# Altium project miniFOdriver_V1.0.PrjPcb
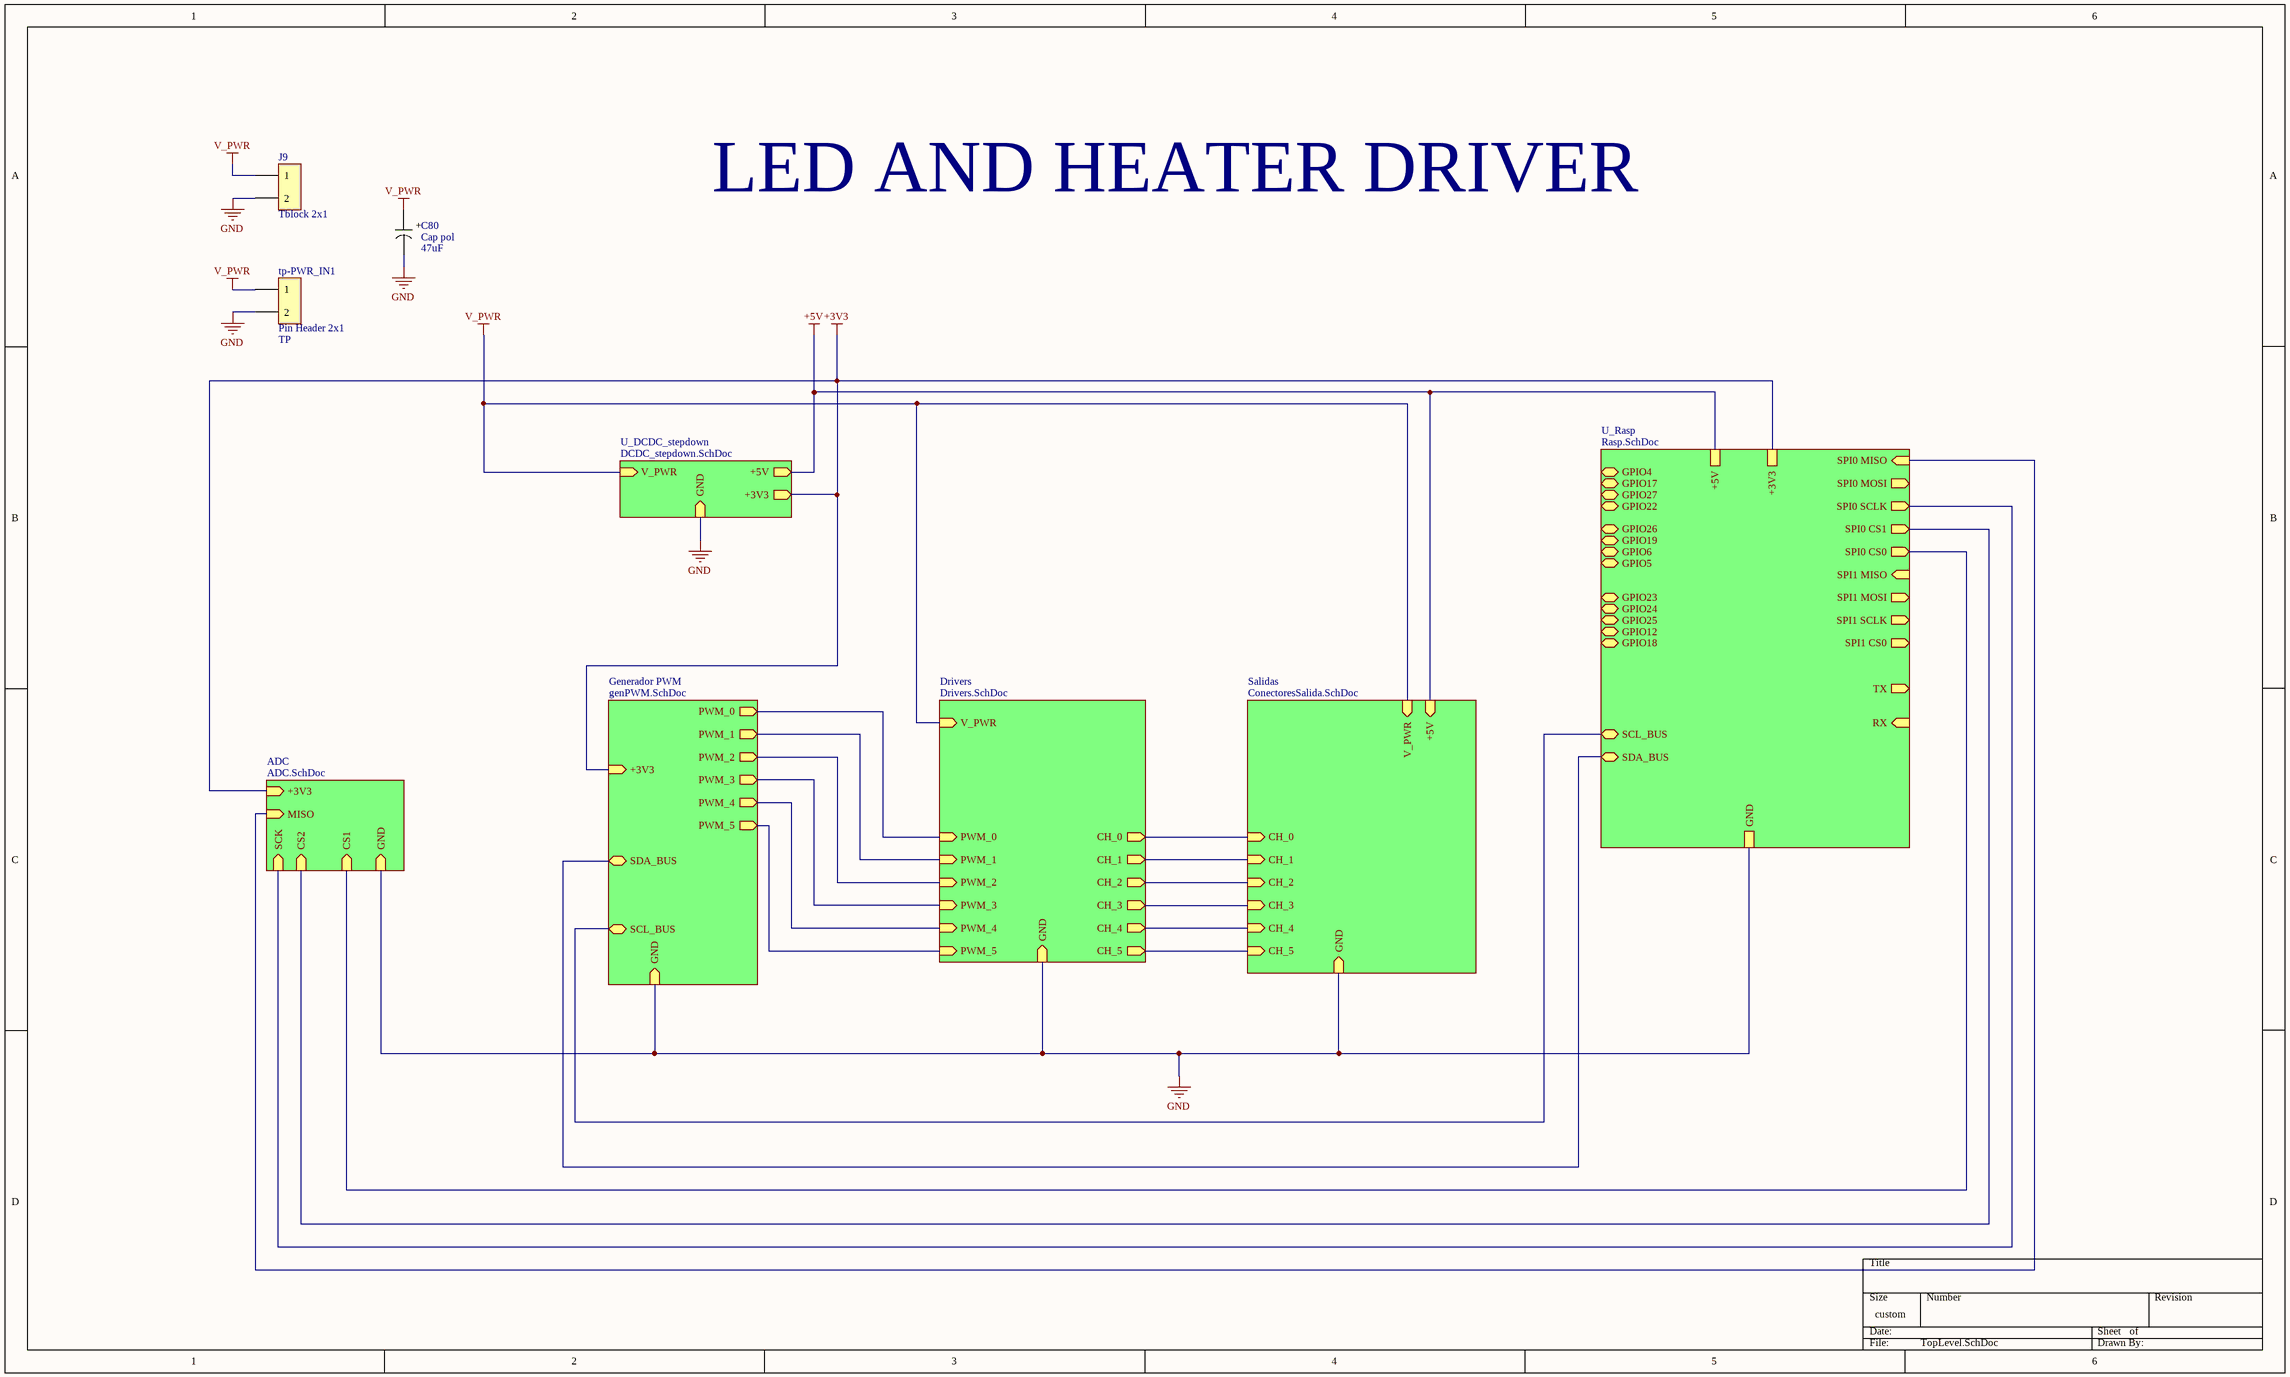
[diagram p0: TopLevel.SchDoc]
7 sheets, 67 parts. Net scope: hierarchical (ports join the sheet entries above them; power ports are global).
Board file: PCB1.PcbDoc
Sheets:
  TopLevel.SchDoc
    Generador PWM = genPWM.SchDoc
    Drivers = Drivers.SchDoc
    Salidas = ConectoresSalida.SchDoc
    ADC = ADC.SchDoc
    U_DCDC_stepdown = DCDC_stepdown.SchDoc
    U_Rasp = Rasp.SchDoc

## Sheet TopLevel.SchDoc
size 508 x 304 mm; DrawnBy: Constanza Barriga; SheetNumber: 1; SheetTotal: 10

### Parts
C80  Cap pol  value 47uF  [CAP_SMD_Electrolytic_5X5.4]
J9  Tblock 2x1  [T_BLOCK_2P]
tp-PWR_IN1  Pin Header 2x1  [HDR-TH_P2.54-H-M_A2541WV-2P]

### Sub-sheets
ADC = ADC.SchDoc: +3V3 (in), GND (in), SCK (in), CS2 (in), MISO (in), CS1 (in)
Drivers = Drivers.SchDoc: GND (in), PWM_4 (in), PWM_3 (in), PWM_2 (in), PWM_1 (in), PWM_0 (in), V_PWR (in), CH_0 (out), CH_1 (out), CH_2 (out), CH_3 (out), CH_4 (out), CH_5 (out), PWM_5 (in)
Generador PWM = genPWM.SchDoc: PWM_0 (out), PWM_1 (out), PWM_2 (out), PWM_3 (out), PWM_4 (out), +3V3 (in), SDA_BUS (bidir), SCL_BUS (bidir), GND (in), PWM_5 (out)
Salidas = ConectoresSalida.SchDoc: V_PWR (in), +5V (in), CH_0 (in), CH_1 (in), CH_2 (in), CH_3 (in), CH_4 (in), GND (in), CH_5 (in)
U_DCDC_stepdown = DCDC_stepdown.SchDoc: V_PWR (in), GND (in), +5V (out), +3V3 (out)
U_Rasp = Rasp.SchDoc: GPIO4 (bidir), GPIO17 (bidir), GPIO27 (bidir), GPIO22 (bidir), SPI0 MOSI (out), SPI0 MISO (in), SPI0 SCLK (out), GPIO26 (bidir), GPIO19 (bidir), GPIO6 (bidir), GPIO5 (bidir), SPI1 MISO (in), SPI1 MOSI (out), SPI0 CS1 (out), SPI1 SCLK (out), SPI0 CS0 (out), RX (in), TX (out), GPIO23 (bidir), GPIO24 (bidir), GPIO25 (bidir), GPIO12 (bidir), SPI1 CS0 (out), GPIO18 (bidir), +5V, +3V3, GND, SCL_BUS (bidir), SDA_BUS (bidir)

### Nets
+3V3: sheet Generador PWM/+3V3, sheet ADC/+3V3, sheet U_DCDC_stepdown/+3V3, sheet U_Rasp/+3V3
+5V: sheet Salidas/+5V, sheet U_DCDC_stepdown/+5V, sheet U_Rasp/+5V
CS1: sheet ADC/CS1, sheet U_Rasp/SPI0 CS0
CS2: sheet ADC/CS2, sheet U_Rasp/SPI0 CS1
GND: C80.1 J9.2 tp-PWR_IN1.2 ; sheet Generador PWM/GND, sheet Drivers/GND, sheet Salidas/GND, sheet ADC/GND, sheet U_DCDC_stepdown/GND, sheet U_Rasp/GND
SCK: sheet ADC/SCK, sheet U_Rasp/SPI0 SCLK
SO: sheet ADC/MISO, sheet U_Rasp/SPI0 MISO
V_PWR: C80.2 J9.1 tp-PWR_IN1.1 ; sheet Drivers/V_PWR, sheet Salidas/V_PWR, sheet U_DCDC_stepdown/V_PWR
CH_0_aux: sheet Drivers/CH_0, sheet Salidas/CH_0
CH_1_aux: sheet Drivers/CH_1, sheet Salidas/CH_1
CH_2_aux: sheet Drivers/CH_2, sheet Salidas/CH_2
CH_3_aux: sheet Drivers/CH_3, sheet Salidas/CH_3
CH_4_aux: sheet Drivers/CH_4, sheet Salidas/CH_4
CH_5_aux: sheet Drivers/CH_5, sheet Salidas/CH_5
PWM_0_in: sheet Generador PWM/PWM_0, sheet Drivers/PWM_0
PWM_1_in: sheet Generador PWM/PWM_1, sheet Drivers/PWM_1
PWM_2_in: sheet Generador PWM/PWM_2, sheet Drivers/PWM_2
PWM_3_in: sheet Generador PWM/PWM_3, sheet Drivers/PWM_3
PWM_4_in: sheet Generador PWM/PWM_4, sheet Drivers/PWM_4
PWM_5_in: sheet Generador PWM/PWM_5, sheet Drivers/PWM_5
SCL_BUS: sheet Generador PWM/SCL_BUS, sheet U_Rasp/SCL_BUS
SDA_BUS: sheet Generador PWM/SDA_BUS, sheet U_Rasp/SDA_BUS

### Notes on the sheet
- LED AND HEATER DRIVER
- (near tp-PWR_IN1) TP
- (in symbol Cap pol) +

### Library data of the parts
C80 = Cap pol: Electrolytic Aluminium Capacitor; Manufacturer: *; Manufacturer Part Number: *; Supplier 1: LCSC; Supplier Part Number 1: *; Voltage: *; Package: *
J9 = Header - 2x1b: Screw terminal 2pos, 1 row, 5pitch; Manufacturer: CJT(Changjiang Connectors); Manufacturer Part Number: A2547WV-2P; Pitch: 2.54mm; Description: P=5.0mm Screw terminal ROHS; Supplier 1: LCSC; Supplier Part Number 1: C8404; Package: Through Hole,P=2.54mm
tp-PWR_IN1 = Header - 2x1c: Pin Header 2pos, 1 row, 2.54 pitch; Manufacturer: CJT(Changjiang Connectors); Manufacturer Part Number: A2541WV-2P; Pitch: 2.54; Supplier 1: LCSC; Supplier Part Number 1: C492401

## Sheet genPWM.SchDoc
size 381 x 203 mm
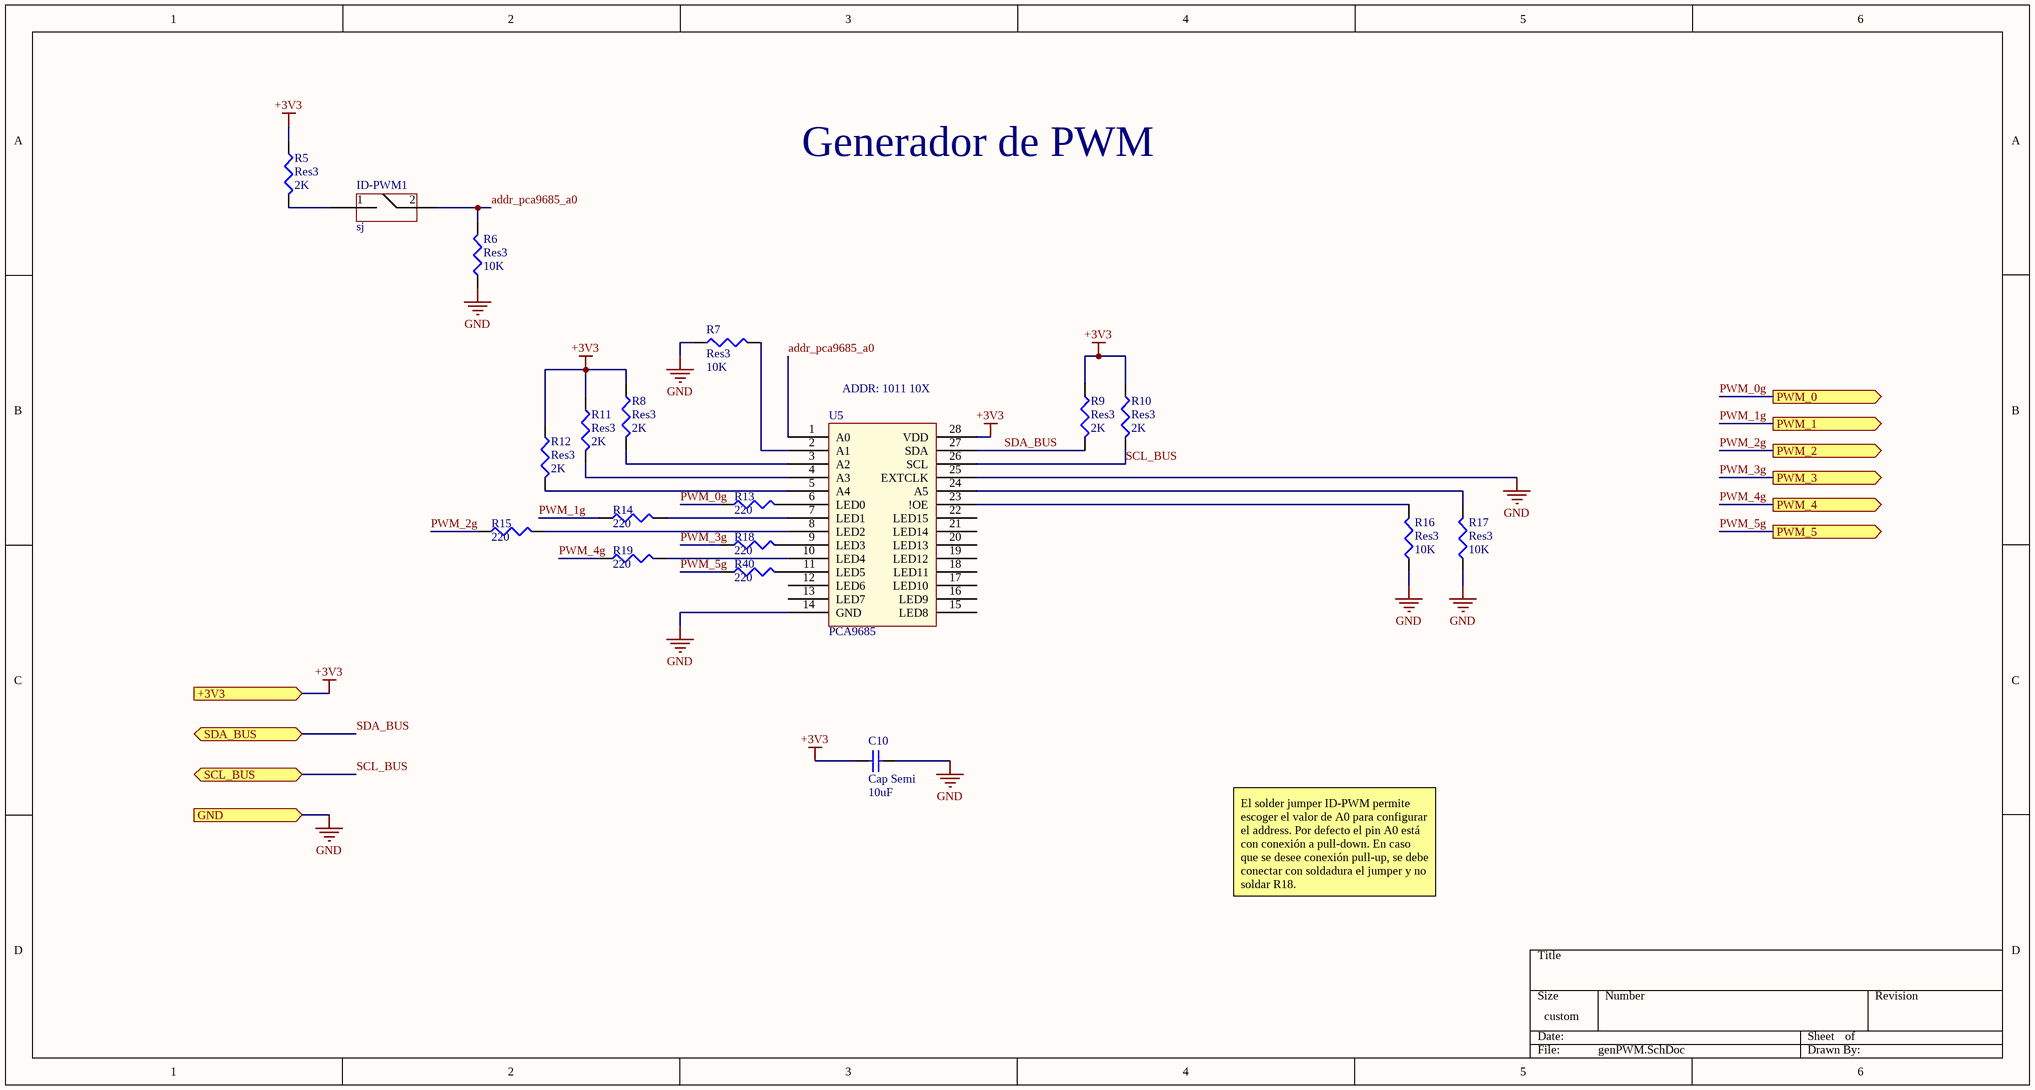
[diagram p1: genPWM.SchDoc]

### Parts
C10  Cap Semi  value 10uF  [1608[0603]]
ID-PWM1  sj  [SJ2]
R5  Res3  value 2K  [J1-0603]
R6  Res3  value 10K  [J1-0603]
R7  Res3  value 10K  [J1-0603]
R8  Res3  value 2K  [J1-0603]
R9  Res3  value 2K  [J1-0603]
R10  Res3  value 2K  [J1-0603]
R11  Res3  value 2K  [J1-0603]
R12  Res3  value 2K  [J1-0603]
R13  value 220  [J1-0603]  (hidden comment: Res3)
R14  value 220  [J1-0603]  (hidden comment: Res3)
R15  value 220  [J1-0603]  (hidden comment: Res3)
R16  Res3  value 10K  [J1-0603]
R17  Res3  value 10K  [J1-0603]
R18  value 220  [J1-0603]  (hidden comment: Res3)
R19  value 220  [J1-0603]  (hidden comment: Res3)
R40  value 220  [J1-0603]  (hidden comment: Res3)
U5  PCA9685  [SSOP-28_L]

### Ports
+3V3 (in), GND (in), PWM_0 (out), PWM_1 (out), PWM_2 (out), PWM_3 (out), PWM_4 (out), PWM_5 (out), SCL_BUS (bidir), SDA_BUS (bidir)

### Nets
+3V3: C10.2 R5.1 R8.1 R9.1 R10.1 R11.1 R12.1 U5.28(VDD) ; port +3V3
GND: C10.1 R6.1 R7.1 R16.1 R17.1 U5.14(GND) U5.25(EXTCLK) ; port GND
addr_pca9685_a0: ID-PWM1.2 R6.2 U5.1(A0)
PWM_0g: R13.1 ; port PWM_0  [project net PWM_0_in]
PWM_1g: R14.1 ; port PWM_1  [project net PWM_1_in]
PWM_2g: R15.1 ; port PWM_2  [project net PWM_2_in]
PWM_3g: R18.1 ; port PWM_3  [project net PWM_3_in]
PWM_4g: R19.1 ; port PWM_4  [project net PWM_4_in]
PWM_5g: R40.1 ; port PWM_5  [project net PWM_5_in]
SCL_BUS: R10.2 U5.26(SCL) ; port SCL_BUS
SDA_BUS: R9.2 U5.27(SDA) ; port SDA_BUS
NetID-PWM1_1: ID-PWM1.1 R5.2
NetR7_2: R7.2 U5.2(A1)
NetR8_2: R8.2 U5.3(A2)
NetR11_2: R11.2 U5.4(A3)
NetR12_2: R12.2 U5.5(A4)
NetR13_2: R13.2 U5.6(LED0)
NetR14_2: R14.2 U5.7(LED1)
NetR15_2: R15.2 U5.8(LED2)
NetR16_2: R16.2 U5.23(!OE)
NetR17_2: R17.2 U5.24(A5)
NetR18_2: R18.2 U5.9(LED3)
NetR19_2: R19.2 U5.10(LED4)
NetR40_2: R40.2 U5.11(LED5)

Not connected (* = marked no-connect by the designer): U5 12(LED6) 13(LED7) 15(LED8) 16(LED9) 17(LED10) 18(LED11) 19(LED12) 20(LED13) 21(LED14) 22(LED15)

### Notes on the sheet
- Generador de PWM
- (near U5) ADDR: 1011 10X
- El solder jumper ID-PWM permite escoger el valor de A0 para configurar el address. Por defecto el pin A0 está con conexión a pull-down. En caso que se desee conexión pull-up, se debe conectar con soldadura el jumper y no soldar R18.

### Library data of the parts
C10 = Cap Semi: Capacitor (Semiconductor SIM Model); Manufacturer: Samsung Electro-Mechanics; Manufacturer Part Number: CL10A106MQ8NNNC; Description: X5R ±20% 16V 10uF 0603 Multilayer Ceramic Capacitors MLCC - SMD/SMT ROHS; Published: 8-Jun-2000; LatestRevisionDate: 29-May-2009; LatestRevisionNote: IPC-7351 Footprint Added.; PackageReference: C1206; Publisher: Altium Limited; PackageDescription: Chip Capacitor; Supplier 1: LCSC; Supplier Part Number 1: C92487
ID-PWM1 = Jumper: solder jumper generic
R5 R8-R12 = Res3: Resistor; Manufacturer: YAGEO; Manufacturer Part Number: RC0603FR-072KL; Description: ±1% 2kΩ ±100ppm/℃ 0.1W 0603 Chip Resistor - Surface Mount ROHS; Published: 8-Jun-2000; LatestRevisionDate: 29-May-2009; LatestRevisionNote: IPC-7351 Footprint Added.; PackageReference: J1-0603; Publisher: Altium Limited; PackageDescription: Chip Resistor; Supplier 1: LCSC; Supplier Part Number 1: C105576
R6 = Res3: Resistor; Manufacturer: PANASONIC; Manufacturer Part Number: ERJPA3F1002V; Description: ±1% 2kΩ ±100ppm/℃ 0.1W 0603 Chip Resistor - Surface Mount ROHS; Published: 8-Jun-2000; LatestRevisionDate: 29-May-2009; LatestRevisionNote: IPC-7351 Footprint Added.; PackageReference: J1-0603; Publisher: Altium Limited; PackageDescription: Chip Resistor; Supplier 1: LCSC; Supplier Part Number 1: C441927
R7 R16 R17 = Res3: Resistor; Manufacturer: PANASONIC; Manufacturer Part Number: ERJPA3F1002V; Published: 8-Jun-2000; LatestRevisionDate: 29-May-2009; LatestRevisionNote: IPC-7351 Footprint Added.; PackageReference: J1-0603; Publisher: Altium Limited; PackageDescription: Chip Resistor; Supplier 1: LCSC; Supplier Part Number 1: C441927
R13-R15 R18 R19 R40 = Res3: Resistor; Manufacturer Part Number: RC0603FR-07220RL; Manufacturer: YAGEO; Published: 8-Jun-2000; LatestRevisionDate: 29-May-2009; LatestRevisionNote: IPC-7351 Footprint Added.; PackageReference: J1-0603; Publisher: Altium Limited; PackageDescription: Chip Resistor; Supplier 1: LCSC; Supplier Part Number 1: C304718
U5 = PCA9685: LED Drivers,16CH, I2C, TSSOP-28; Manufacturer: NXP Semicon; Manufacturer Part Number: PCA9685PW/Q900,118; Package: TSSOP-28; Supplier 1: LCSC; Supplier Part Number 1: C92206

## Sheet Drivers.SchDoc
size 457 x 304 mm
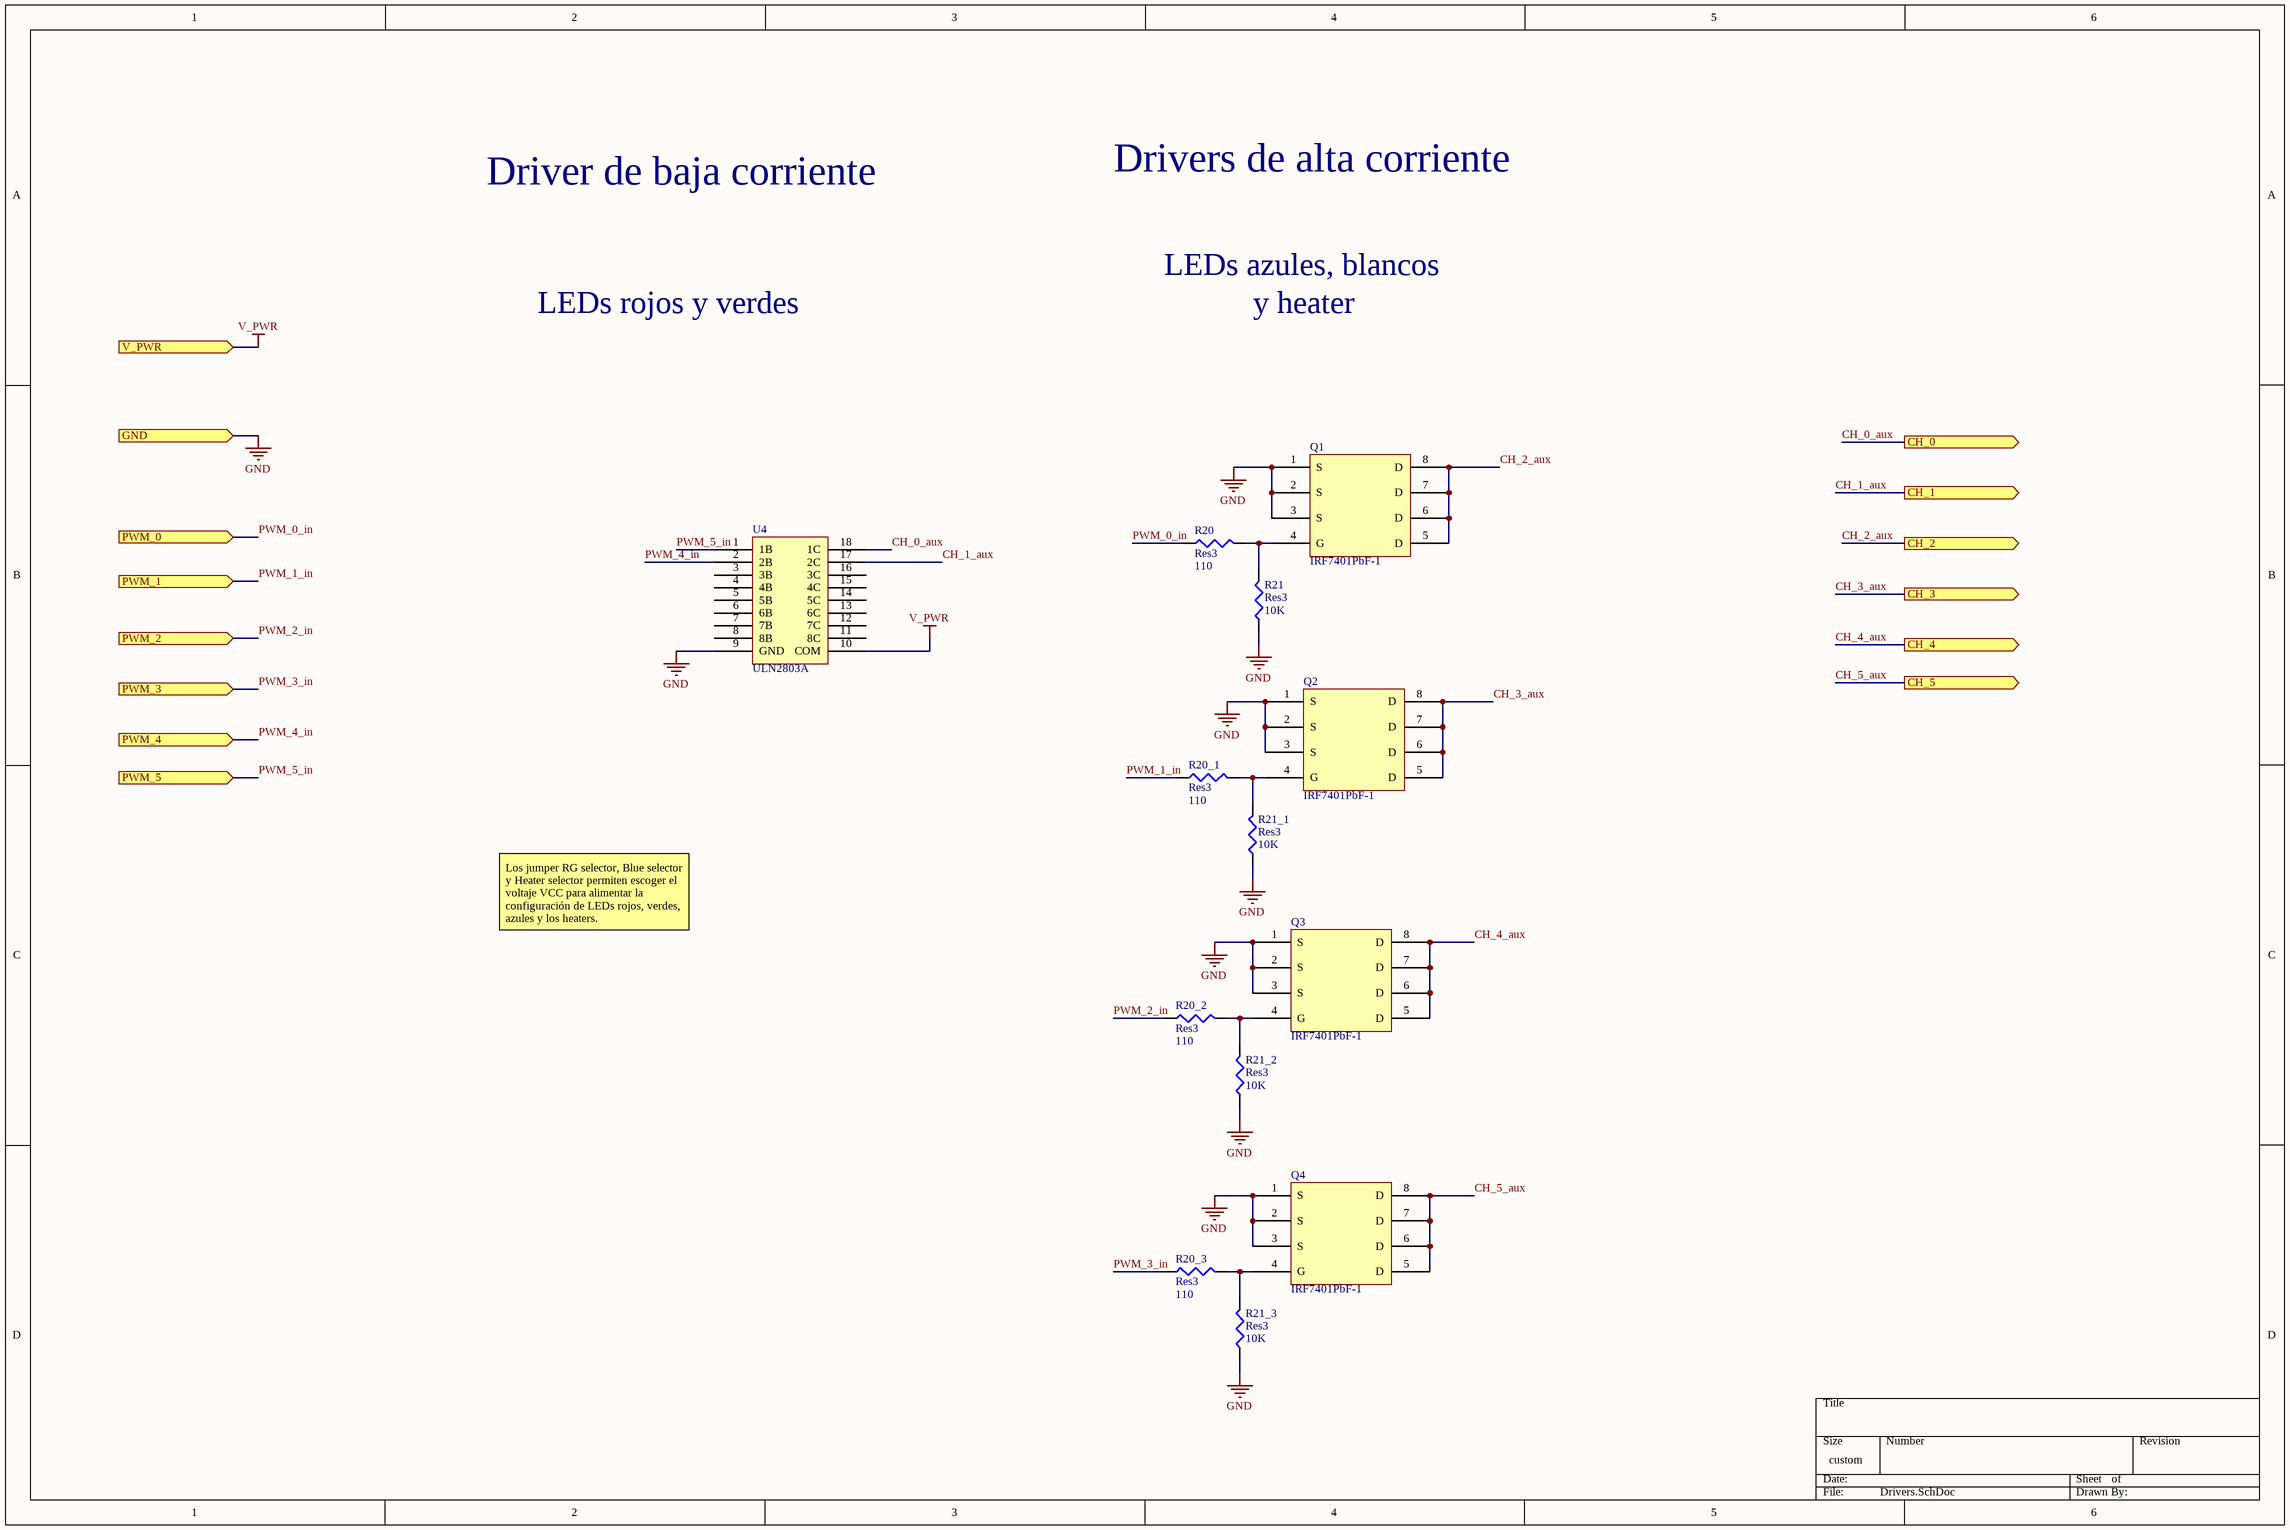
[diagram p2: Drivers.SchDoc]

### Parts
Q1  IRF7401PbF-1  [SOIC8]
Q2  IRF7401PbF-1  [SOIC8]
Q3  IRF7401PbF-1  [SOIC8]
Q4  IRF7401PbF-1  [SOIC8]
R20  Res3  value 110  [J1-0603]
R20_1  Res3  value 110  [J1-0603]
R20_2  Res3  value 110  [J1-0603]
R20_3  Res3  value 110  [J1-0603]
R21  Res3  value 10K  [J1-0603]
R21_1  Res3  value 10K  [J1-0603]
R21_2  Res3  value 10K  [J1-0603]
R21_3  Res3  value 10K  [J1-0603]
U4  ULN2803A  [SOIC18]

### Ports
CH_0 (out), CH_1 (out), CH_2 (out), CH_3 (out), CH_4 (out), CH_5 (out), GND (in), PWM_0 (in), PWM_1 (in), PWM_2 (in), PWM_3 (in), PWM_4 (in), PWM_5 (in), V_PWR (in)

### Nets
GND: Q1.1(S) Q1.2(S) Q1.3(S) Q2.1(S) Q2.2(S) Q2.3(S) Q3.1(S) Q3.2(S) Q3.3(S) Q4.1(S) Q4.2(S) Q4.3(S) R21.1 R21_1.1 R21_2.1 R21_3.1 U4.9(GND) ; port GND
V_PWR: U4.10(COM) ; port V_PWR
CH_0_aux: U4.18(1C) ; port CH_0
CH_1_aux: U4.17(2C) ; port CH_1
CH_2_aux: Q1.5(D) Q1.6(D) Q1.7(D) Q1.8(D) ; port CH_2
CH_3_aux: Q2.5(D) Q2.6(D) Q2.7(D) Q2.8(D) ; port CH_3
CH_4_aux: Q3.5(D) Q3.6(D) Q3.7(D) Q3.8(D) ; port CH_4
CH_5_aux: Q4.5(D) Q4.6(D) Q4.7(D) Q4.8(D) ; port CH_5
PWM_0_in: R20.1 ; port PWM_0
PWM_1_in: R20_1.1 ; port PWM_1
PWM_2_in: R20_2.1 ; port PWM_2
PWM_3_in: R20_3.1 ; port PWM_3
PWM_4_in: U4.2(2B) ; port PWM_4
PWM_5_in: U4.1(1B) ; port PWM_5
NetQ1_4: Q1.4(G) R20.2 R21.2
NetQ2_4: Q2.4(G) R20_1.2 R21_1.2
NetQ3_4: Q3.4(G) R20_2.2 R21_2.2
NetQ4_4: Q4.4(G) R20_3.2 R21_3.2

Not connected (* = marked no-connect by the designer): U4 3(3B) 4(4B) 5(5B) 6(6B) 7(7B) 8(8B) 11(8C) 12(7C) 13(6C) 14(5C) 15(4C) 16(3C)

### Notes on the sheet
- Driver de baja corriente
- Drivers de alta corriente
- LEDs azules, blancos
- LEDs rojos y verdes
- y heater
- Los jumper RG selector, Blue selector y Heater selector permiten escoger el voltaje VCC para alimentar la configuración de LEDs rojos, verdes, azules y los heaters.

### Library data of the parts
Q1-Q4 = IRF7401: MOSFET N Channel 20V 8.7A 700mV @ 250uA 22mΩ @ 4.1A,4.5V SOIC-8_150mil RoHS; Manufacturer: Infineon Technologies; Manufacturer Part Number: IRF7401TRPBF; Description: 6.8A 2.5W 20V 0.035Ω 4.1A,4.5V N Channel 0.7V 250uA SOIC-8_150mil MOSFETs ROHS; Package: SO-8; Supplier 1: LCSC; Supplier Part Number 1: C169089
R20 R20_1-R20_3 = Res3: Resistor; Manufacturer: ROHM Semicon; Manufacturer Part Number: MCR03EZPFX1100; Description: ±1% 110Ω ±100ppm/℃ 0.1W 0603 Chip Resistor - Surface Mount ROHS; Published: 8-Jun-2000; LatestRevisionDate: 29-May-2009; LatestRevisionNote: IPC-7351 Footprint Added.; PackageReference: J1-0603; Publisher: Altium Limited; PackageDescription: Chip Resistor; Supplier 1: LCSC; Supplier Part Number 1: C22781
R21 R21_1-R21_3 = Res3: as R6 on sheet genPWM; Published: 8-Jun-2000; LatestRevisionDate: 29-May-2009; LatestRevisionNote: IPC-7351 Footprint Added.; PackageReference: J1-0603; Publisher: Altium Limited; PackageDescription: Chip Resistor; Supplier 1: LCSC; Supplier Part Number 1: C25804
U4 = ULN2803: Darlington transistor array driver SOIC-18_300mi; Manufacturer: Texas instrument; Manufacturer Part Number: ULN2803ADWR; Description: SOIC-18_300mil Darlington Transistor Arrays ROHS; Supplier 1: LCSC; Supplier Part Number 1: C33924; Package: SOIC-18_300mil

## Sheet ConectoresSalida.SchDoc
size 533 x 304 mm
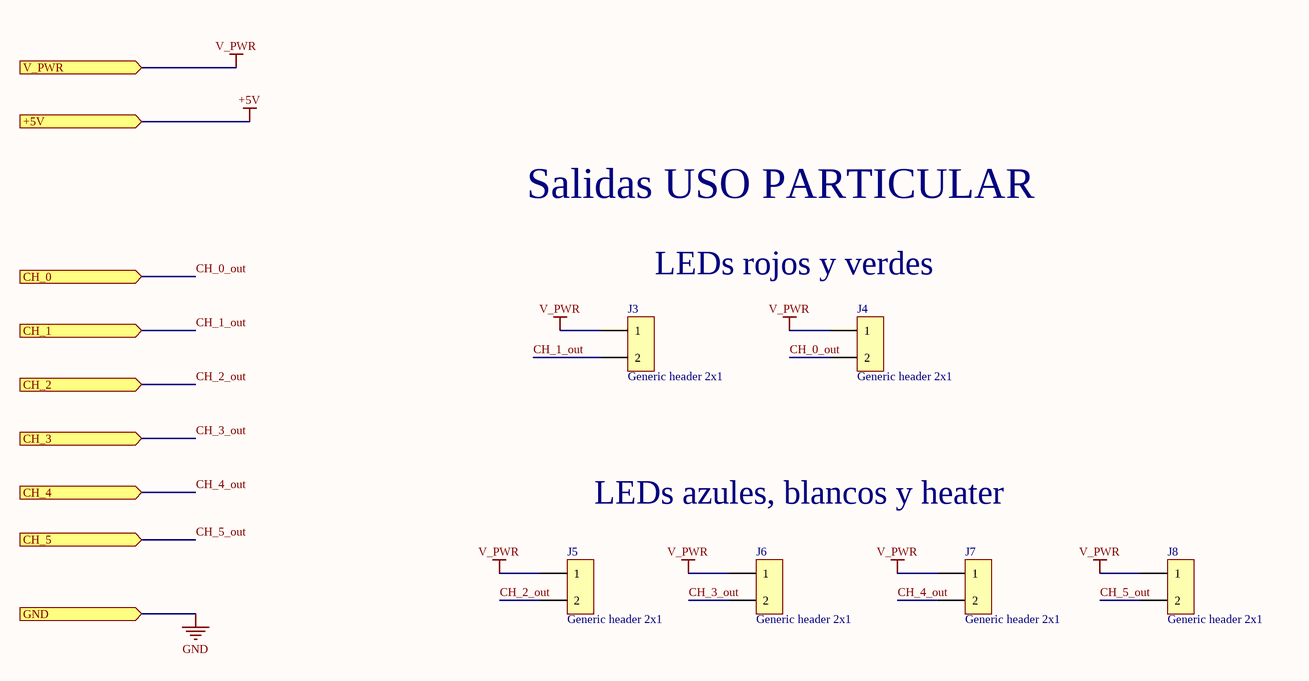
[diagram p3: ConectoresSalida.SchDoc]

### Parts
J3  Generic header 2x1  [JST-2x1]
J4  Generic header 2x1  [JST-2x1]
J5  Generic header 2x1  [JST-2x1]
J6  Generic header 2x1  [JST-2x1]
J7  Generic header 2x1  [JST-2x1]
J8  Generic header 2x1  [JST-2x1]

### Ports
+5V (in), CH_0 (in), CH_1 (in), CH_2 (in), CH_3 (in), CH_4 (in), CH_5 (in), GND (in), V_PWR (in)

### Nets
V_PWR: J3.1 J4.1 J5.1 J6.1 J7.1 J8.1 ; port V_PWR
CH_0_out: J4.2 ; port CH_0  [project net CH_0_aux]
CH_1_out: J3.2 ; port CH_1  [project net CH_1_aux]
CH_2_out: J5.2 ; port CH_2  [project net CH_2_aux]
CH_3_out: J6.2 ; port CH_3  [project net CH_3_aux]
CH_4_out: J7.2 ; port CH_4  [project net CH_4_aux]
CH_5_out: J8.2 ; port CH_5  [project net CH_5_aux]

### Notes on the sheet
- Salidas USO PARTICULAR
- LEDs rojos y verdes
- LEDs azules, blancos y heater

### Library data of the parts
J3-J8 = Header - 2x1: Generic Header 2pos, 1 row, 2.54 pitch; Manufacturer: CJT(Changjiang Connectors); Manufacturer Part Number: A2547WV-2P; Pitch: 2.54mm; Description: 2 Header XH 0.098"(2.50mm) Male Pin Through Hole Wire To Board / Wire To Wire Connector ROHS; Supplier 1: LCSC; Supplier Part Number 1: C20079; Package: Through Hole,P=2.54mm

## Sheet ADC.SchDoc
size A4
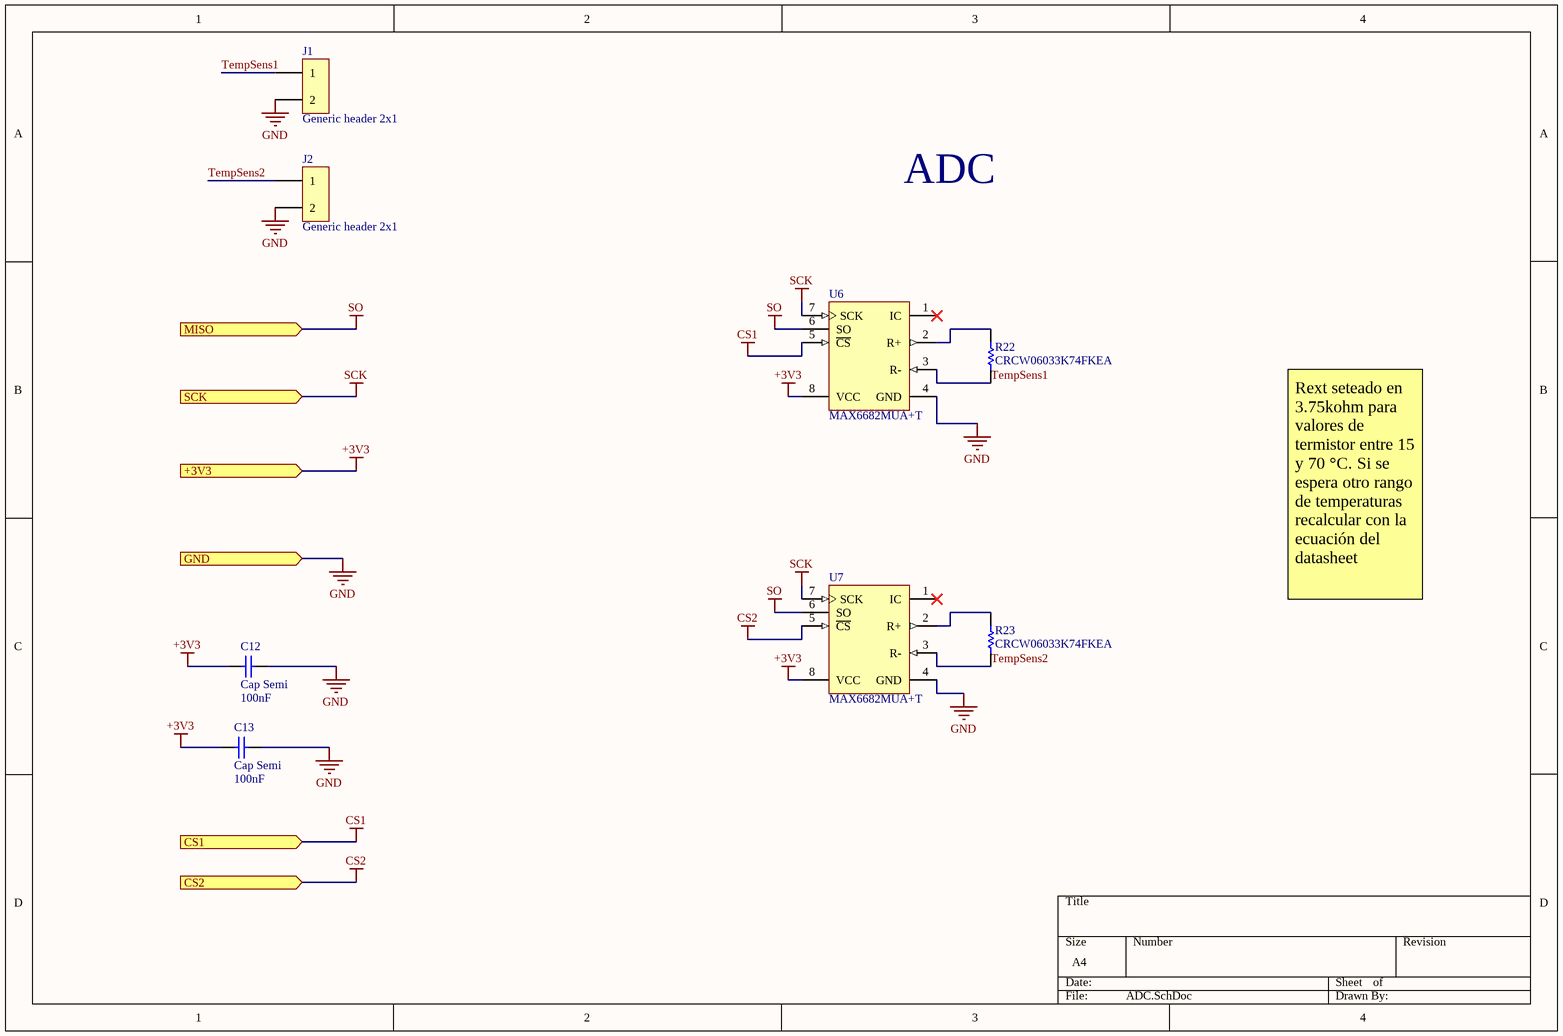
[diagram p4: ADC.SchDoc]

### Parts
C12  Cap Semi  value 100nF  [1608[0603]]
C13  Cap Semi  value 100nF  [1608[0603]]
J1  Generic header 2x1  [JST-2x1]
J2  Generic header 2x1  [JST-2x1]
R22  CRCW06033K74FKEA  [RESC1609X50X30LL10T20]
R23  CRCW06033K74FKEA  [RESC1609X50X30LL10T20]
U6  MAX6682MUA+T  [MAXM-U8+1_L]
U7  MAX6682MUA+T  [MAXM-U8+1_L]

### Ports
+3V3 (in), CS1 (in), CS2 (in), GND (in), MISO (in), SCK (in)

### Nets
+3V3: C12.2 C13.2 U6.8(VCC) U7.8(VCC) ; port +3V3
CS1: U6.5(~{CS}) ; port CS1
CS2: U7.5(~{CS}) ; port CS2
GND: C12.1 C13.1 J1.2 J2.2 U6.4(GND) U7.4(GND) ; port GND
SCK: U6.7(SCK) U7.7(SCK) ; port SCK
SO: U6.6(SO) U7.6(SO) ; port MISO
TempSens1: J1.1 R22.1 U6.3(R-)
TempSens2: J2.1 R23.1 U7.3(R-)
NetR22_2: R22.2 U6.2(R+)
NetR23_2: R23.2 U7.2(R+)

Not connected (* = marked no-connect by the designer): U6 1(IC)*; U7 1(IC)*

### Notes on the sheet
- ADC
- Rext seteado en 3.75kohm para valores de termistor entre 15 y 70 °C. Si se espera otro rango de temperaturas recalcular con la ecuación del datasheet

### Library data of the parts
C12 C13 = Cap Semi: Capacitor (Semiconductor SIM Model); Manufacturer: Taiyo Yuden; Manufacturer Part Number: UMK107B104KAHT; Description: X7R 100nF ±10% 16V 0603 Multilayer Ceramic Capacitors MLCC - SMD/SMT ROHS; Published: 8-Jun-2000; LatestRevisionDate: 29-May-2009; LatestRevisionNote: IPC-7351 Footprint Added.; PackageReference: C0603; Publisher: Altium Limited; PackageDescription: Chip Capacitor; Supplier 1: LCSC; Supplier Part Number 1: C66501
J1 J2 = Header - 2x1: as J3 on sheet ConectoresSalida; Supplier 1: LCSC; Supplier Part Number 1: C20079; Package: Through Hole,P=2.54mm
R22 R23 = CMP-2000-03309-1: Manufacturer: Vishay Dale; Description: 4.22kΩ ±1% ±100ppm/℃ 0.1W 0603 Chip Resistor - Surface Mount ROHS; Value: 4.22k; Part Number: CRCW06033K74FKEA; Supplier 1: LCSC; Supplier Part Number 1: C170595
U6 U7 = CMP-0253-01037-1: Thermistor-to-Digital Converter, 10 Bits Temperature Resolution, -55 to 125 degC, 8-Pin SOP (U8+1), Pb-Free, Tape and Reel; Interface: 3-Wire/SPI; Parasite Pwr.: No; Functions: Thermistor-to-Digital Converter; DatasheetVersion: Rev. 0; ComponentLink2Description: Datasheet; PackageReference: U8+1; PartNumber: MAX6682MUA+T; PackageDescription: 8-Pin Micro-MAX, Thin Shrink Small-Outline (U8+1), Body 3 x 3 mm, Pitch 0.65 mm; Packing: Tape and Reel; ComponentLink1Description: Manufacturer URL; ComponentLink3URL: http://pdfserv.maximintegrated.com/package_dwgs/21-0036.PDF; ComponentLink2URL: http://datasheets.maximintegrated.com/en/ds/MAX6682.pdf; ComponentLink3Description: Package Specification; Generic Part Number: MAX6682; PackageVersion: Rev. L, 08/2009; ComponentLink1URL: http://www.maximintegrated.com/; Code_JEDEC: MO-187; Mounting Technology: Surface Mount; Supplier 1: LCSC; Supplier Part Number 1: C2653145

## Sheet DCDC_stepdown.SchDoc
size 381 x 304 mm; DrawnBy: Constanza Barriga
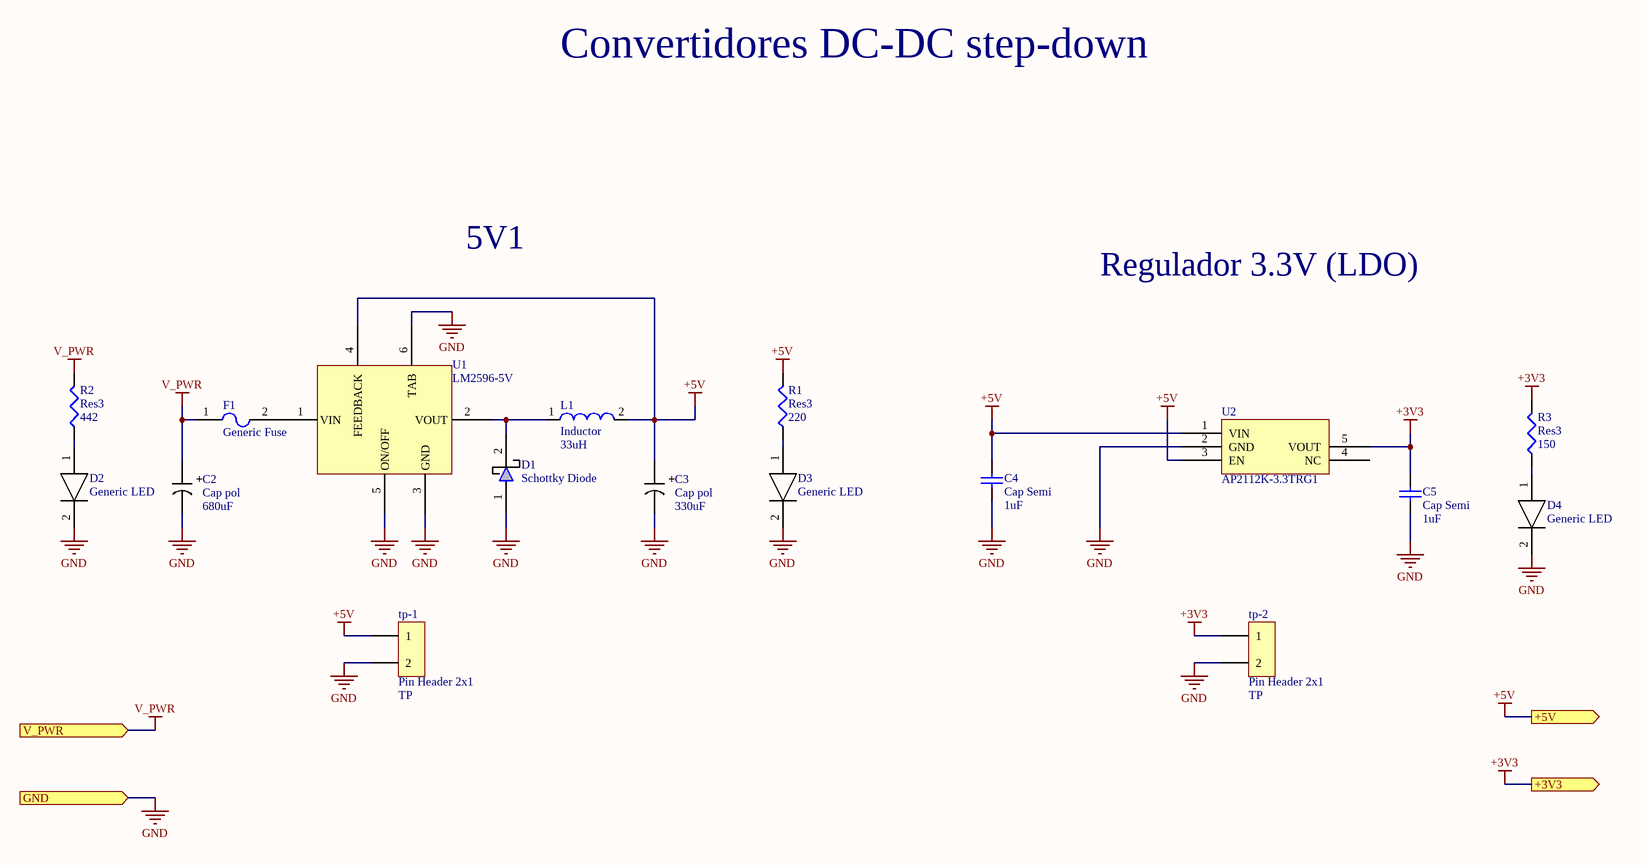
[diagram p5: DCDC_stepdown.SchDoc]

### Parts
C2  Cap pol  value 680uF  [CAP_SMD_Electrolytic_10x10]
C3  Cap pol  value 330uF  [CAP_SMD_Electrolytic_10x10]
C4  Cap Semi  value 1uF  [1608[0603]]
C5  Cap Semi  value 1uF  [1608[0603]]
D1  Schottky Diode  [SMB_L4.6-W3.6-LS5.3-RD]
D2  Generic LED  [LED0603]
D3  Generic LED  [LED0603]
D4  Generic LED  [LED0603]
F1  Generic Fuse  [F1206]
L1  Inductor  value 33uH  [IND-SMD_L12.5-W12.5_SMDRS1275]
R1  Res3  value 220  [J1-0603]
R2  Res3  value 442  [J1-0603]
R3  Res3  value 150  [J1-0603]
tp-1  Pin Header 2x1  [HDR-TH_P2.54-H-M_A2541WV-2P]
tp-2  Pin Header 2x1  [HDR-TH_P2.54-H-M_A2541WV-2P]
U1  LM2596-5V  [TO-263-5]
U2  AP2112K-3.3TRG1  [SOT25-5]

### Ports
+3V3 (out), +5V (out), GND (in), V_PWR (in)

### Nets
+3V3: C5.2 R3.2 tp-2.1 U2.5(VOUT) ; port +3V3
+5V: C3.2 C4.2 L1.2 R1.2 tp-1.1 U1.4(FEEDBACK) U2.1(VIN) U2.3(EN) ; port +5V
GND: C2.1 C3.1 C4.1 C5.1 D1.1(+) D2.2 D3.2 D4.2 tp-1.2 tp-2.2 U1.3(GND) U1.5(ON/OFF) U1.6(TAB) U2.2(GND) ; port GND
V_PWR: C2.2 F1.1 R2.2 ; port V_PWR
NetD1_2: D1.2(-) L1.1 U1.2(VOUT)
NetD2_1: D2.1 R2.1
NetD3_1: D3.1 R1.1
NetD4_1: D4.1 R3.1
NetF1_2: F1.2 U1.1(VIN)

Not connected (* = marked no-connect by the designer): U2 4(NC)

### Notes on the sheet
- Convertidores DC-DC step-down
- 5V1
- Regulador 3.3V (LDO)
- (near tp-1) TP
- (near tp-2) TP
- (in symbol Cap pol) +

### Library data of the parts
C2 = Cap pol: Electrolytic Aluminium Capacitor; Manufacturer: PANASONIC; Manufacturer Part Number: EEEFK1V681AQ; Voltage: 35V; Supplier 1: LCSC; Supplier Part Number 1: C178568; Package: SMD,12.5x13.5mm
C3 = Cap pol: Electrolytic Aluminium Capacitor; Manufacturer: PANASONIC; Manufacturer Part Number: EEE1VA331UAP; Voltage: 35V; Description: -45℃~+105℃ 35V 2000hrs 105℃ 330uF 10mm ±20% 10mm SMD,10x10mm Aluminum Electrolytic Capacitors - SMD ROHS; Supplier 1: LCSC; Supplier Part Number 1: C249650; Package: SMD, 10X10mm
C4 C5 = Cap Semi: Capacitor (Semiconductor SIM Model); Manufacturer: Samsung Electro-Mechanics; Manufacturer Part Number: CL10B105KO8NNNC; Description: X7R ±10% 1uF 16V 0603 Multilayer Ceramic Capacitors MLCC - SMD/SMT ROHS; Published: 8-Jun-2000; LatestRevisionDate: 29-May-2009; LatestRevisionNote: IPC-7351 Footprint Added.; PackageReference: C0603; Publisher: Altium Limited; PackageDescription: Chip Capacitor; Supplier 1: LCSC; Supplier Part Number 1: C59782
D1 = Schottky Diode: Schottky Diodes; Manufacturer: MCC(Micro Commercial Components); Manufacturer Part Number: SK32B-LTP; Reverse voltage: 20V; Description: 20V 3A 500mV @ 3A SMB(DO-214AA) Schottky Barrier Diodes (SBD) ROHS; Package: SMB; Supplier 1: LCSC; Supplier Part Number 1: C180191
D2-D4 = LED: Generic LED SMD; Color: Green; Description: Green 520~535nm 0603 Light Emitting Diodes (LED) ROHS; Package: 0603; Supplier 1: LCSC; Supplier Part Number 1: C72043
F1 = FUSE: SMD Fuse; Manufacturer: AEM; Manufacturer Part Number: F1206VH4500TM; Rated Voltage AC: 65V; Current Rating: 4.5A; Description: 3.9 60A 4.5A SMD Ceramic Fuse 24mΩ 1206 Fuses ROHS; Supplier 1: LCSC; Supplier Part Number 1: C310980; Package: 1206
L1 = Inductor: Inductor SMD; Manufacturer: GLE; Manufacturer Part Number: GCRH127M-330MC; Description: SMD Power Inductors ROHS; Supplier 1: LCSC; Supplier Part Number 1: C439422; Package: SMD,12.3x12.3x8mm
R1 = Res3: ±1% ±100ppm/℃ 0.1W 220Ω 0603 Chip Resistor - Surface Mount ROHS; Manufacturer Part Number: AC0603FR-07442RL; Manufacturer: YAGEO; Published: 8-Jun-2000; LatestRevisionDate: 29-May-2009; LatestRevisionNote: IPC-7351 Footprint Added.; PackageReference: J1-0603; Publisher: Altium Limited; PackageDescription: Chip Resistor; Supplier 1: LCSC; Supplier Part Number 1: C304718
R2 = Res3: Resistor; Manufacturer Part Number: AC0603FR-07442RL; Manufacturer: YAGEO; Description: ±1% 442Ω ±100ppm/℃ 0.1W 0603 Chip Resistor - Surface Mount ROHS; Published: 8-Jun-2000; LatestRevisionDate: 29-May-2009; LatestRevisionNote: IPC-7351 Footprint Added.; PackageReference: J1-0603; Publisher: Altium Limited; PackageDescription: Chip Resistor; Supplier 1: LCSC; Supplier Part Number 1: C23057
R3 = Res3: Resistor; Manufacturer Part Number: AC0603FR-07442RL; Manufacturer: YAGEO; Description: ±1% ±100ppm/℃ 150Ω 0.1W 0603 Chip Resistor - Surface Mount ROHS; Published: 8-Jun-2000; LatestRevisionDate: 29-May-2009; LatestRevisionNote: IPC-7351 Footprint Added.; PackageReference: J1-0603; Publisher: Altium Limited; PackageDescription: Chip Resistor; Supplier 1: LCSC; Supplier Part Number 1: C114608
tp-1 tp-2 = Header - 2x1c: as tp-PWR_IN1 on sheet TopLevel; Supplier 1: LCSC; Supplier Part Number 1: C492401
U1 = LM2596-5V: Step-Down Positive Fixed 1 3A 150kHz TO-263-5 DC-DC Converters RoHS; Manufacturer: HTC Korea TAEJIN Tech; Manufacturer Part Number: LM2596R-5.0; Description: 3A 40V TO-263-5 DC-DC Converters ROHS; Package: TO-263-5; Supplier 1: LCSC; Supplier Part Number 1: C77782
U2 = AP2112K-3.3: 600mA CMOS LDO REGULATOR WITH ENABLE; Manufacturer: DIODES; Description: 6V 400mV @ 600mA Fixed 3.3V SOT-25 Linear Voltage Regulators (LDO) ROHS; Package: SOT-25-5_L3.0-W1.8-P0.95-LS3.0-BL; Supplier 1: LCSC; Supplier Part Number 1: C150742; Manufacturer Part Number: AP2112K-3.3TRG1

## Sheet Rasp.SchDoc
size A4
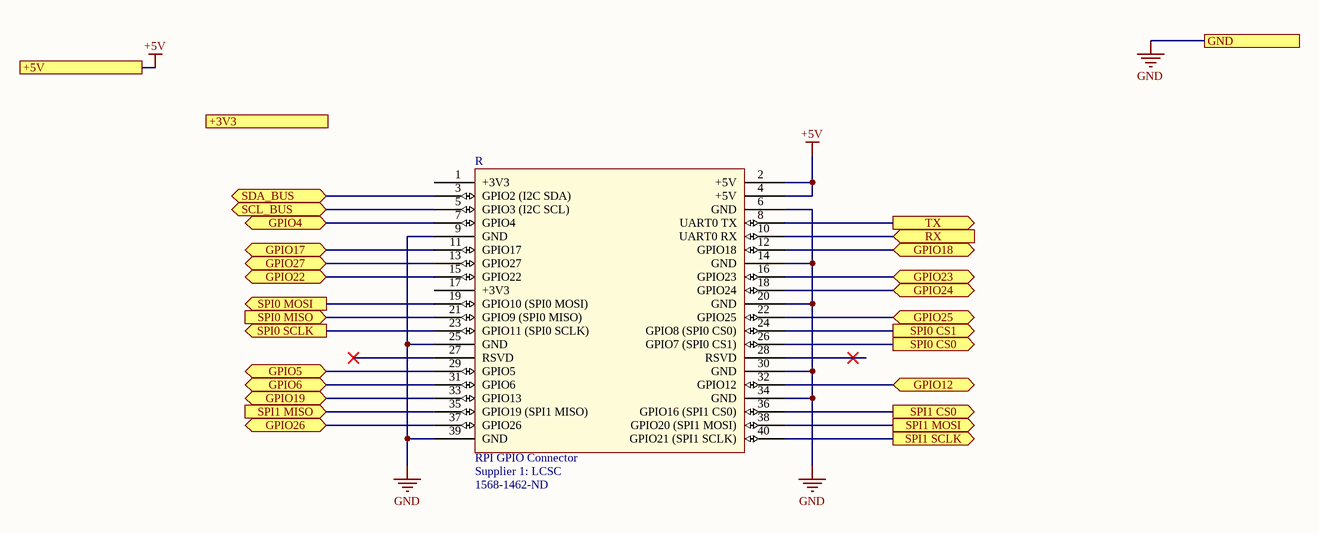
[diagram p6: Rasp.SchDoc]

### Parts
R  RPI GPIO Connector  Supplier 1: LCSC  Supplier Part Number 1: 1568-1462-ND  [rpi]

### Ports
+3V3, +5V, GND, GPIO4 (bidir), GPIO5 (bidir), GPIO6 (bidir), GPIO12 (bidir), GPIO17 (bidir), GPIO18 (bidir), GPIO19 (bidir), GPIO22 (bidir), GPIO23 (bidir), GPIO24 (bidir), GPIO25 (bidir), GPIO26 (bidir), GPIO27 (bidir), RX (in), SCL_BUS (bidir), SDA_BUS (bidir), SPI0 CS0 (out), SPI0 CS1 (out), SPI0 MISO (in), SPI0 MOSI (out), SPI0 SCLK (out), SPI1 CS0 (out), SPI1 MISO (in), SPI1 MOSI (out), SPI1 SCLK (out), TX (out)

### Nets
+5V: R.2(+5V) R.4(+5V) ; port +5V
CS1: R.26(GPIO7_(SPI0_CS1)) ; port SPI0 CS0
CS2: R.24(GPIO8_(SPI0_CS0)) ; port SPI0 CS1
GND: R.6(GND) R.9(GND) R.14(GND) R.20(GND) R.25(GND) R.30(GND) R.34(GND) R.39(GND) ; port GND
SCK: R.23(GPIO11_(SPI0_SCLK)) ; port SPI0 SCLK
SO: R.21(GPIO9_(SPI0_MISO)) ; port SPI0 MISO
SCL_BUS: R.5(GPIO3_(I2C_SCL)) ; port SCL_BUS
SDA_BUS: R.3(GPIO2_(I2C_SDA)) ; port SDA_BUS
NetR_7: R.7(GPIO4) ; port GPIO4
NetR_8: R.8(UART0_TX) ; port TX
NetR_10: R.10(UART0_RX) ; port RX
NetR_11: R.11(GPIO17) ; port GPIO17
NetR_12: R.12(GPIO18) ; port GPIO18
NetR_13: R.13(GPIO27) ; port GPIO27
NetR_15: R.15(GPIO22) ; port GPIO22
NetR_16: R.16(GPIO23) ; port GPIO23
NetR_18: R.18(GPIO24) ; port GPIO24
NetR_19: R.19(GPIO10_(SPI0_MOSI)) ; port SPI0 MOSI
NetR_22: R.22(GPIO25) ; port GPIO25
NetR_29: R.29(GPIO5) ; port GPIO5
NetR_31: R.31(GPIO6) ; port GPIO6
NetR_32: R.32(GPIO12) ; port GPIO12
NetR_33: R.33(GPIO13) ; port GPIO19
NetR_35: R.35(GPIO19_(SPI1_MISO)) ; port SPI1 MISO
NetR_36: R.36(GPIO16_(SPI1_CS0)) ; port SPI1 CS0
NetR_37: R.37(GPIO26) ; port GPIO26
NetR_38: R.38(GPIO20_(SPI1_MOSI)) ; port SPI1 MOSI
NetR_40: R.40(GPIO21_(SPI1_SCLK)) ; port SPI1 SCLK

Not connected (* = marked no-connect by the designer): R 1(+3V3) 17(+3V3) 27(RSVD)* 28(RSVD)*

### Library data of the parts
R = rpi connector: GPIO Header for Raspberry Pi A+/B+/Pi 2/Pi 3 - 2x20; Manufacturer: SparkFun Electronics; Manufacturer Part Number: PRT-14017; Nils Minor: author; nilsminor@web.de: mail; RoHS: RoHS Compliant; Category: Development Boards, Kits, Programmers; Stock 1: 150; Pricing 1: 1=1.84 (EUR); Part Status: Active; Accessory Type: Connector; For Use With/Related Products: Raspberry Pi; ComponentLink1URL: https://cdn.sparkfun.com/datasheets/Dev/RaspberryPi/12313.pdf; ComponentLink1Description: https://cdn.sparkfun.com/datasheets/Dev/RaspberryPi/12313.pdf

## Nets that join several sheets
+3V3: genPWM (8 pins), ADC (C12.2 C13.2 U6.8 U7.8), DCDC_stepdown (C5.2 R3.2 tp-2.1 U2.5)
+5V: DCDC_stepdown (8 pins), Rasp (R.2 R.4)
CS1: ADC (U6.5), Rasp (R.26)
CS2: ADC (U7.5), Rasp (R.24)
GND: TopLevel (C80.1 J9.2 tp-PWR_IN1.2), genPWM (7 pins), Drivers (17 pins), ADC (6 pins), DCDC_stepdown (14 pins), Rasp (8 pins)
SCK: ADC (U6.7 U7.7), Rasp (R.23)
SO: ADC (U6.6 U7.6), Rasp (R.21)
V_PWR: TopLevel (C80.2 J9.1 tp-PWR_IN1.1), Drivers (U4.10), ConectoresSalida (6 pins), DCDC_stepdown (C2.2 F1.1 R2.2)
CH_0_aux: Drivers (U4.18), ConectoresSalida (J4.2)
CH_1_aux: Drivers (U4.17), ConectoresSalida (J3.2)
CH_2_aux: Drivers (Q1.5 Q1.6 Q1.7 Q1.8), ConectoresSalida (J5.2)
CH_3_aux: Drivers (Q2.5 Q2.6 Q2.7 Q2.8), ConectoresSalida (J6.2)
CH_4_aux: Drivers (Q3.5 Q3.6 Q3.7 Q3.8), ConectoresSalida (J7.2)
CH_5_aux: Drivers (Q4.5 Q4.6 Q4.7 Q4.8), ConectoresSalida (J8.2)
PWM_0_in: genPWM (R13.1), Drivers (R20.1)
PWM_1_in: genPWM (R14.1), Drivers (R20_1.1)
PWM_2_in: genPWM (R15.1), Drivers (R20_2.1)
PWM_3_in: genPWM (R18.1), Drivers (R20_3.1)
PWM_4_in: genPWM (R19.1), Drivers (U4.2)
PWM_5_in: genPWM (R40.1), Drivers (U4.1)
SCL_BUS: genPWM (R10.2 U5.26), Rasp (R.5)
SDA_BUS: genPWM (R9.2 U5.27), Rasp (R.3)